# EAGLE schematic PIC Development Board (EAGLE 7.5.0)

## Sheet 1 of 4
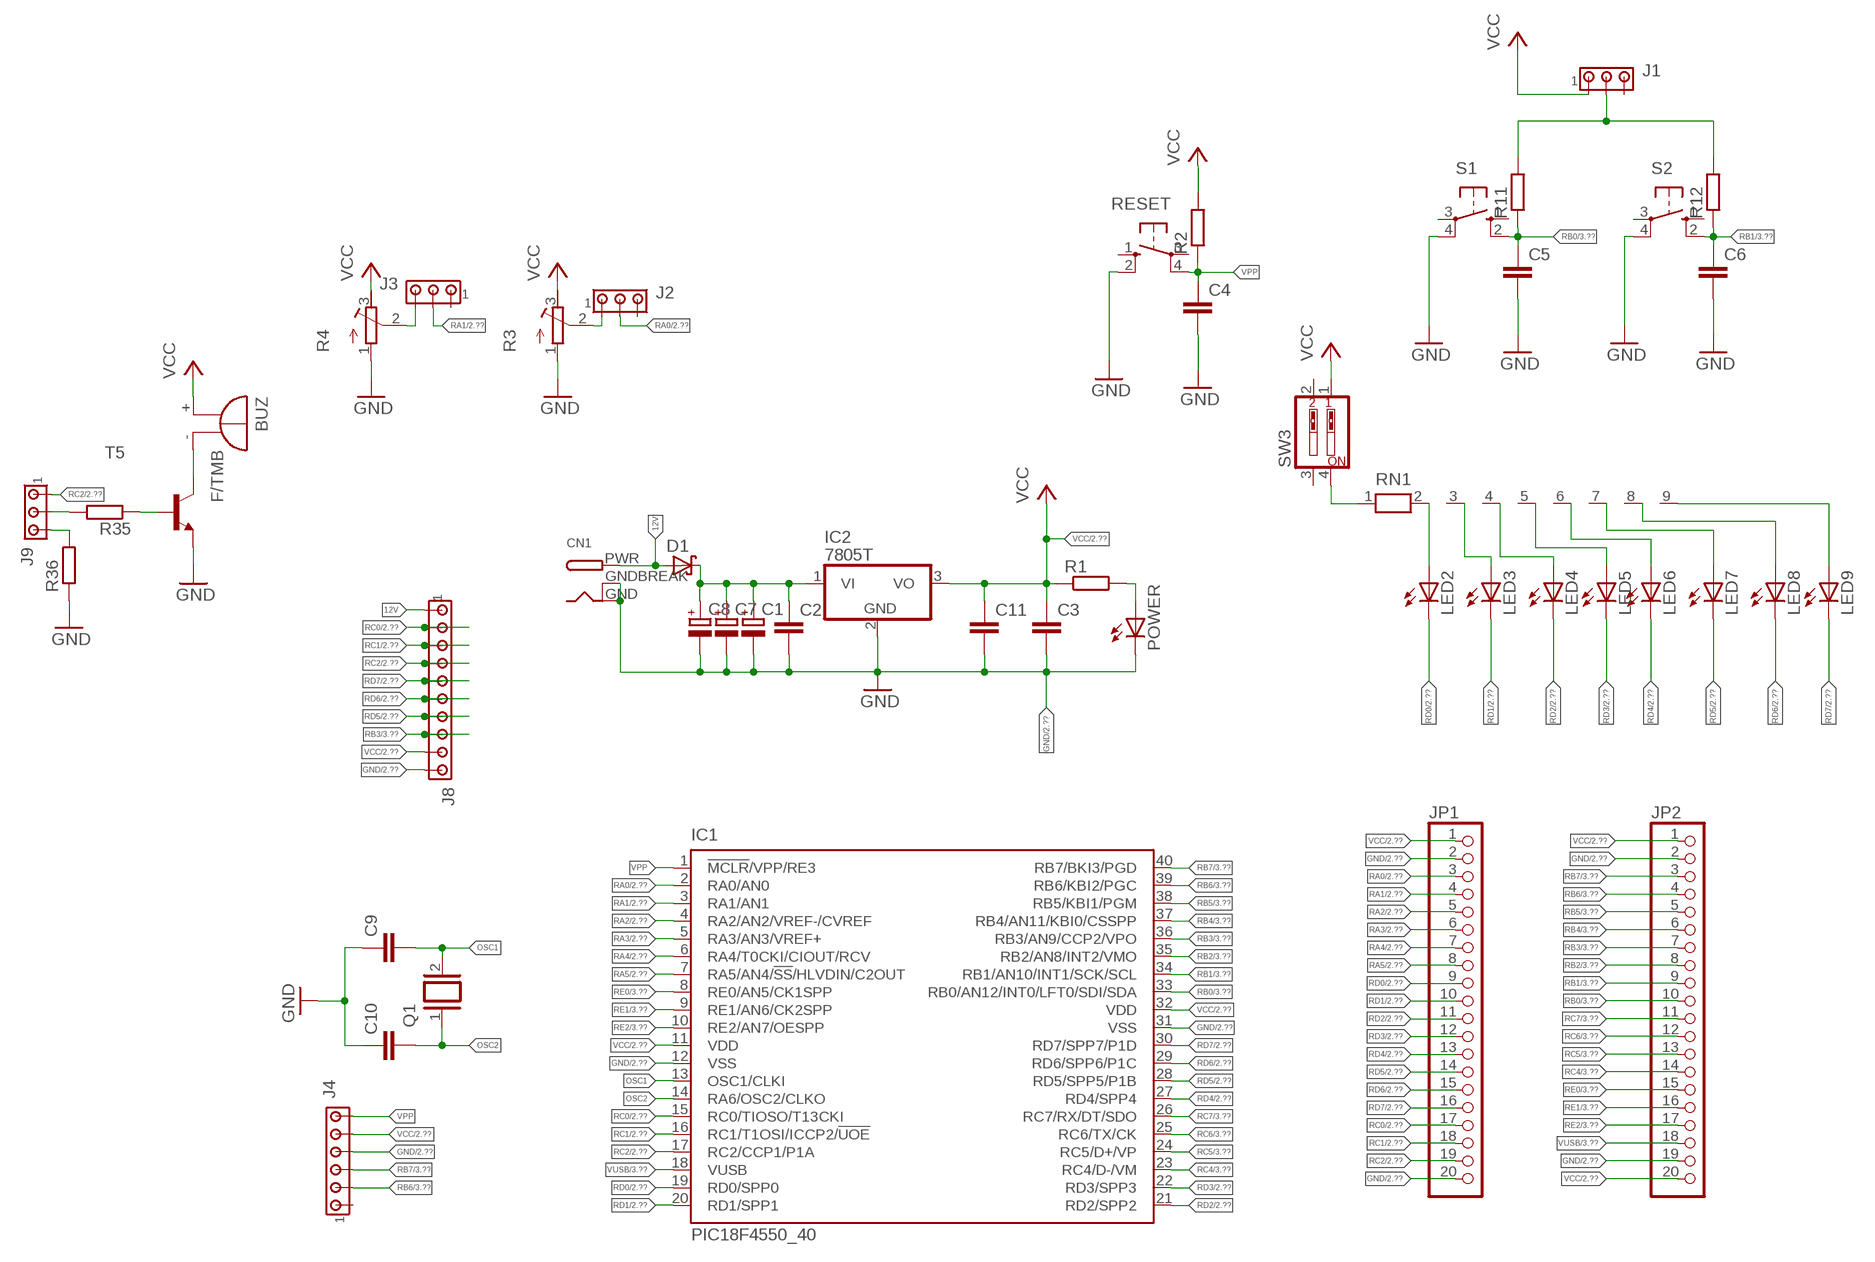
[diagram p0: schematic, sheet 1]

### Parts
BUZ  F/TMB  [F/TMB]
C1  CPOL-EUE2,5-6E  [E2,5-6E]
C2  C-EU050-025X075  [C050-025X075]
C3  C-EU050-025X075  [C050-025X075]
C4  C-EU050-025X075  [C050-025X075]
C5  C-EU025-024X044  [C025-024X044]
C6  C-EU025-024X044  [C025-024X044]
C7  CPOL-EUE2,5-6E  [E2,5-6E]
C8  CPOL-EUE2,5-6E  [E2,5-6E]
C9  C-EU025-030X050  [C025-030X050]
C10  C-EU025-030X050  [C025-030X050]
C11  C-EU050-025X075  [C050-025X075]
CN1  DCBARRELPTH  [DCJACK_2MM_PTH]
D1  SCHOTTKY-DIODEF126Z12  [F126Z12]
IC1  PIC18F4550_40  [DIL40]
IC2  7805T  [TO220H]
J1  MTA03-100  [10X03MTA]
J2  MTA03-100  [10X03MTA]
J3  MTA03-100  [10X03MTA]
J4  MTA06-100  [10X06MTA]
J8  MTA10-100  [10X10MTA]
J9  MTA03-100  [10X03MTA]
JP1  PINHD-1X20  [1X20]
JP2  PINHD-1X20  [1X20]
LED2  LEDSQR2X5  [LED2X5]
LED3  LEDSQR2X5  [LED2X5]
LED4  LEDSQR2X5  [LED2X5]
LED5  LEDSQR2X5  [LED2X5]
LED6  LEDSQR2X5  [LED2X5]
LED7  LEDSQR2X5  [LED2X5]
LED8  LEDSQR2X5  [LED2X5]
LED9  LEDSQR2X5  [LED2X5]
POWER  LED3MM  [LED3MM]
Q1  XTAL/S  [QS]
R1  R-EU_0204/7  [0204/7]
R2  R-EU_0204/7  [0204/7]
R3  R-TRIMM3296P  [RTRIM3296P]
R4  R-TRIMM3296P  [RTRIM3296P]
R11  R-EU_0204/7  [0204/7]
R12  R-EU_0204/7  [0204/7]
R35  R-EU_0204/7  [0204/7]
R36  R-EU_0204/7  [0204/7]
RESET  10-XX  [B3F-10XX]
RN1  RN08  [RN-9]
S1  10-XX  [B3F-10XX]
S2  10-XX  [B3F-10XX]
SW3  SW_DIP-2  [EDG-02]
T5  BC547A-NPN-TO92-CBE  [TO92-CBE]

### Nets
12V: CN1.PWR D1.A J8.1
GND: C1.- C2.2 C3.2 C4.2 C5.2 C6.2 C7.- C8.- C9.1 C10.1 C11.2 CN1.GND CN1.GNDBREAK IC1.12(VSS) IC1.31(VSS) IC2.2(GND) J4.4 J8.10 JP1.2 JP1.20 JP2.2 JP2.19 POWER.K(C) R3.1(A) R4.1(A) R36.1 RESET.2(S1) S1.4(P1) S2.4(P1) T5.E ; also sheet 2,3
N$1: C1.+ C2.1 C7.+ C8.+ D1.C IC2.1(VI)
N$2: LED2.A RN1.2
N$3: J9.2 R35.2
N$4: LED3.A RN1.3
N$5: POWER.A R1.2
N$6: J2.1 R3.2(S)
N$7: LED4.A RN1.4
N$8: LED5.A RN1.5
N$9: LED6.A RN1.6
N$10: LED7.A RN1.7
N$11: LED8.A RN1.8
N$12: LED9.A RN1.9
N$14: J3.3 R4.2(S)
N$18: RN1.1 SW3.4
N$56: J1.2 R11.2 R12.2
N$57: BUZ.- T5.C
N$58: R35.1 T5.B
N$59: J9.3 R36.2
OSC1: C9.2 IC1.13(OSC1/CLKI) Q1.2
OSC2: C10.2 IC1.14(RA6/OSC2/CLKO) Q1.1
RA0: IC1.2(RA0/AN0) J2.2 JP1.3 ; also sheet 2
RA1: IC1.3(RA1/AN1) J3.2 JP1.4 ; also sheet 2
RA2: IC1.4(RA2/AN2/VREF-/CVREF) JP1.5 ; also sheet 2
RA3: IC1.5(RA3/AN3/VREF+) JP1.6 ; also sheet 2
RA4: IC1.6(RA4/T0CKI/CIOUT/RCV) JP1.7 ; also sheet 2
RA5: IC1.7(RA5/AN4/!SS!/HLVDIN/C2OUT) JP1.8 ; also sheet 2
RB0: C5.1 IC1.33(RB0/AN12/INT0/LFT0/SDI/SDA) JP2.10 R11.1 S1.2(S1) ; also sheet 3
RB1: C6.1 IC1.34(RB1/AN10/INT1/SCK/SCL) JP2.9 R12.1 S2.2(S1) ; also sheet 3
RB2: IC1.35(RB2/AN8/INT2/VMO) JP2.8 ; also sheet 3
RB3: IC1.36(RB3/AN9/CCP2/VPO) J8.8 JP2.7 ; also sheet 3
RB4: IC1.37(RB4/AN11/KBI0/CSSPP) JP2.6 ; also sheet 3
RB5: IC1.38(RB5/KBI1/PGM) JP2.5 ; also sheet 3
RB6: IC1.39(RB6/KBI2/PGC) J4.2 JP2.4 ; also sheet 3
RB7: IC1.40(RB7/BKI3/PGD) J4.3 JP2.3 ; also sheet 3
RC0: IC1.15(RC0/TIOSO/T13CKI) J8.2 JP1.17 ; also sheet 2
RC1: IC1.16(RC1/T1OSI/ICCP2/!UOE) J8.3 JP1.18 ; also sheet 2
RC2: IC1.17(RC2/CCP1/P1A) J8.4 J9.1 JP1.19 ; also sheet 2
RC4: IC1.23(RC4/D-/VM) JP2.14 ; also sheet 3
RC5: IC1.24(RC5/D+/VP) JP2.13 ; also sheet 3
RC6: IC1.25(RC6/TX/CK) JP2.12 ; also sheet 3
RC7: IC1.26(RC7/RX/DT/SDO) JP2.11 ; also sheet 3
RD0: IC1.19(RD0/SPP0) JP1.9 LED2.K(C) ; also sheet 2
RD1: IC1.20(RD1/SPP1) JP1.10 LED3.K(C) ; also sheet 2
RD2: IC1.21(RD2/SPP2) JP1.11 LED4.K(C) ; also sheet 2
RD3: IC1.22(RD3/SPP3) JP1.12 LED5.K(C) ; also sheet 2
RD4: IC1.27(RD4/SPP4) JP1.13 LED6.K(C) ; also sheet 2
RD5: IC1.28(RD5/SPP5/P1B) J8.7 JP1.14 LED7.K(C) ; also sheet 2
RD6: IC1.29(RD6/SPP6/P1C) J8.6 JP1.15 LED8.K(C) ; also sheet 2
RD7: IC1.30(RD7/SPP7/P1D) J8.5 JP1.16 LED9.K(C) ; also sheet 2
RE0: IC1.8(RE0/AN5/CK1SPP) JP2.15 ; also sheet 3
RE1: IC1.9(RE1/AN6/CK2SPP) JP2.16 ; also sheet 3
RE2: IC1.10(RE2/AN7/OESPP) JP2.17 ; also sheet 3
VCC: BUZ.+ C3.1 C11.1 IC1.11(VDD) IC1.32(VDD) IC2.3(VO) J1.1 J4.5 J8.9 JP1.1 JP2.1 JP2.20 R1.1 R2.2 R3.3(E) R4.3(E) SW3.1 ; also sheet 2,3
VPP: C4.1 IC1.1(!MCLR!/VPP/RE3) J4.6 R2.1 RESET.4(P1)
VUSB: IC1.18(VUSB) JP2.18 ; also sheet 3
Unconnected: J1.3 J2.3 J3.1 J4.1 RESET.1(S) RESET.3(P) S1.1(S) S1.3(P) S2.1(S) S2.3(P) SW3.2 SW3.3

## Sheet 2 of 4
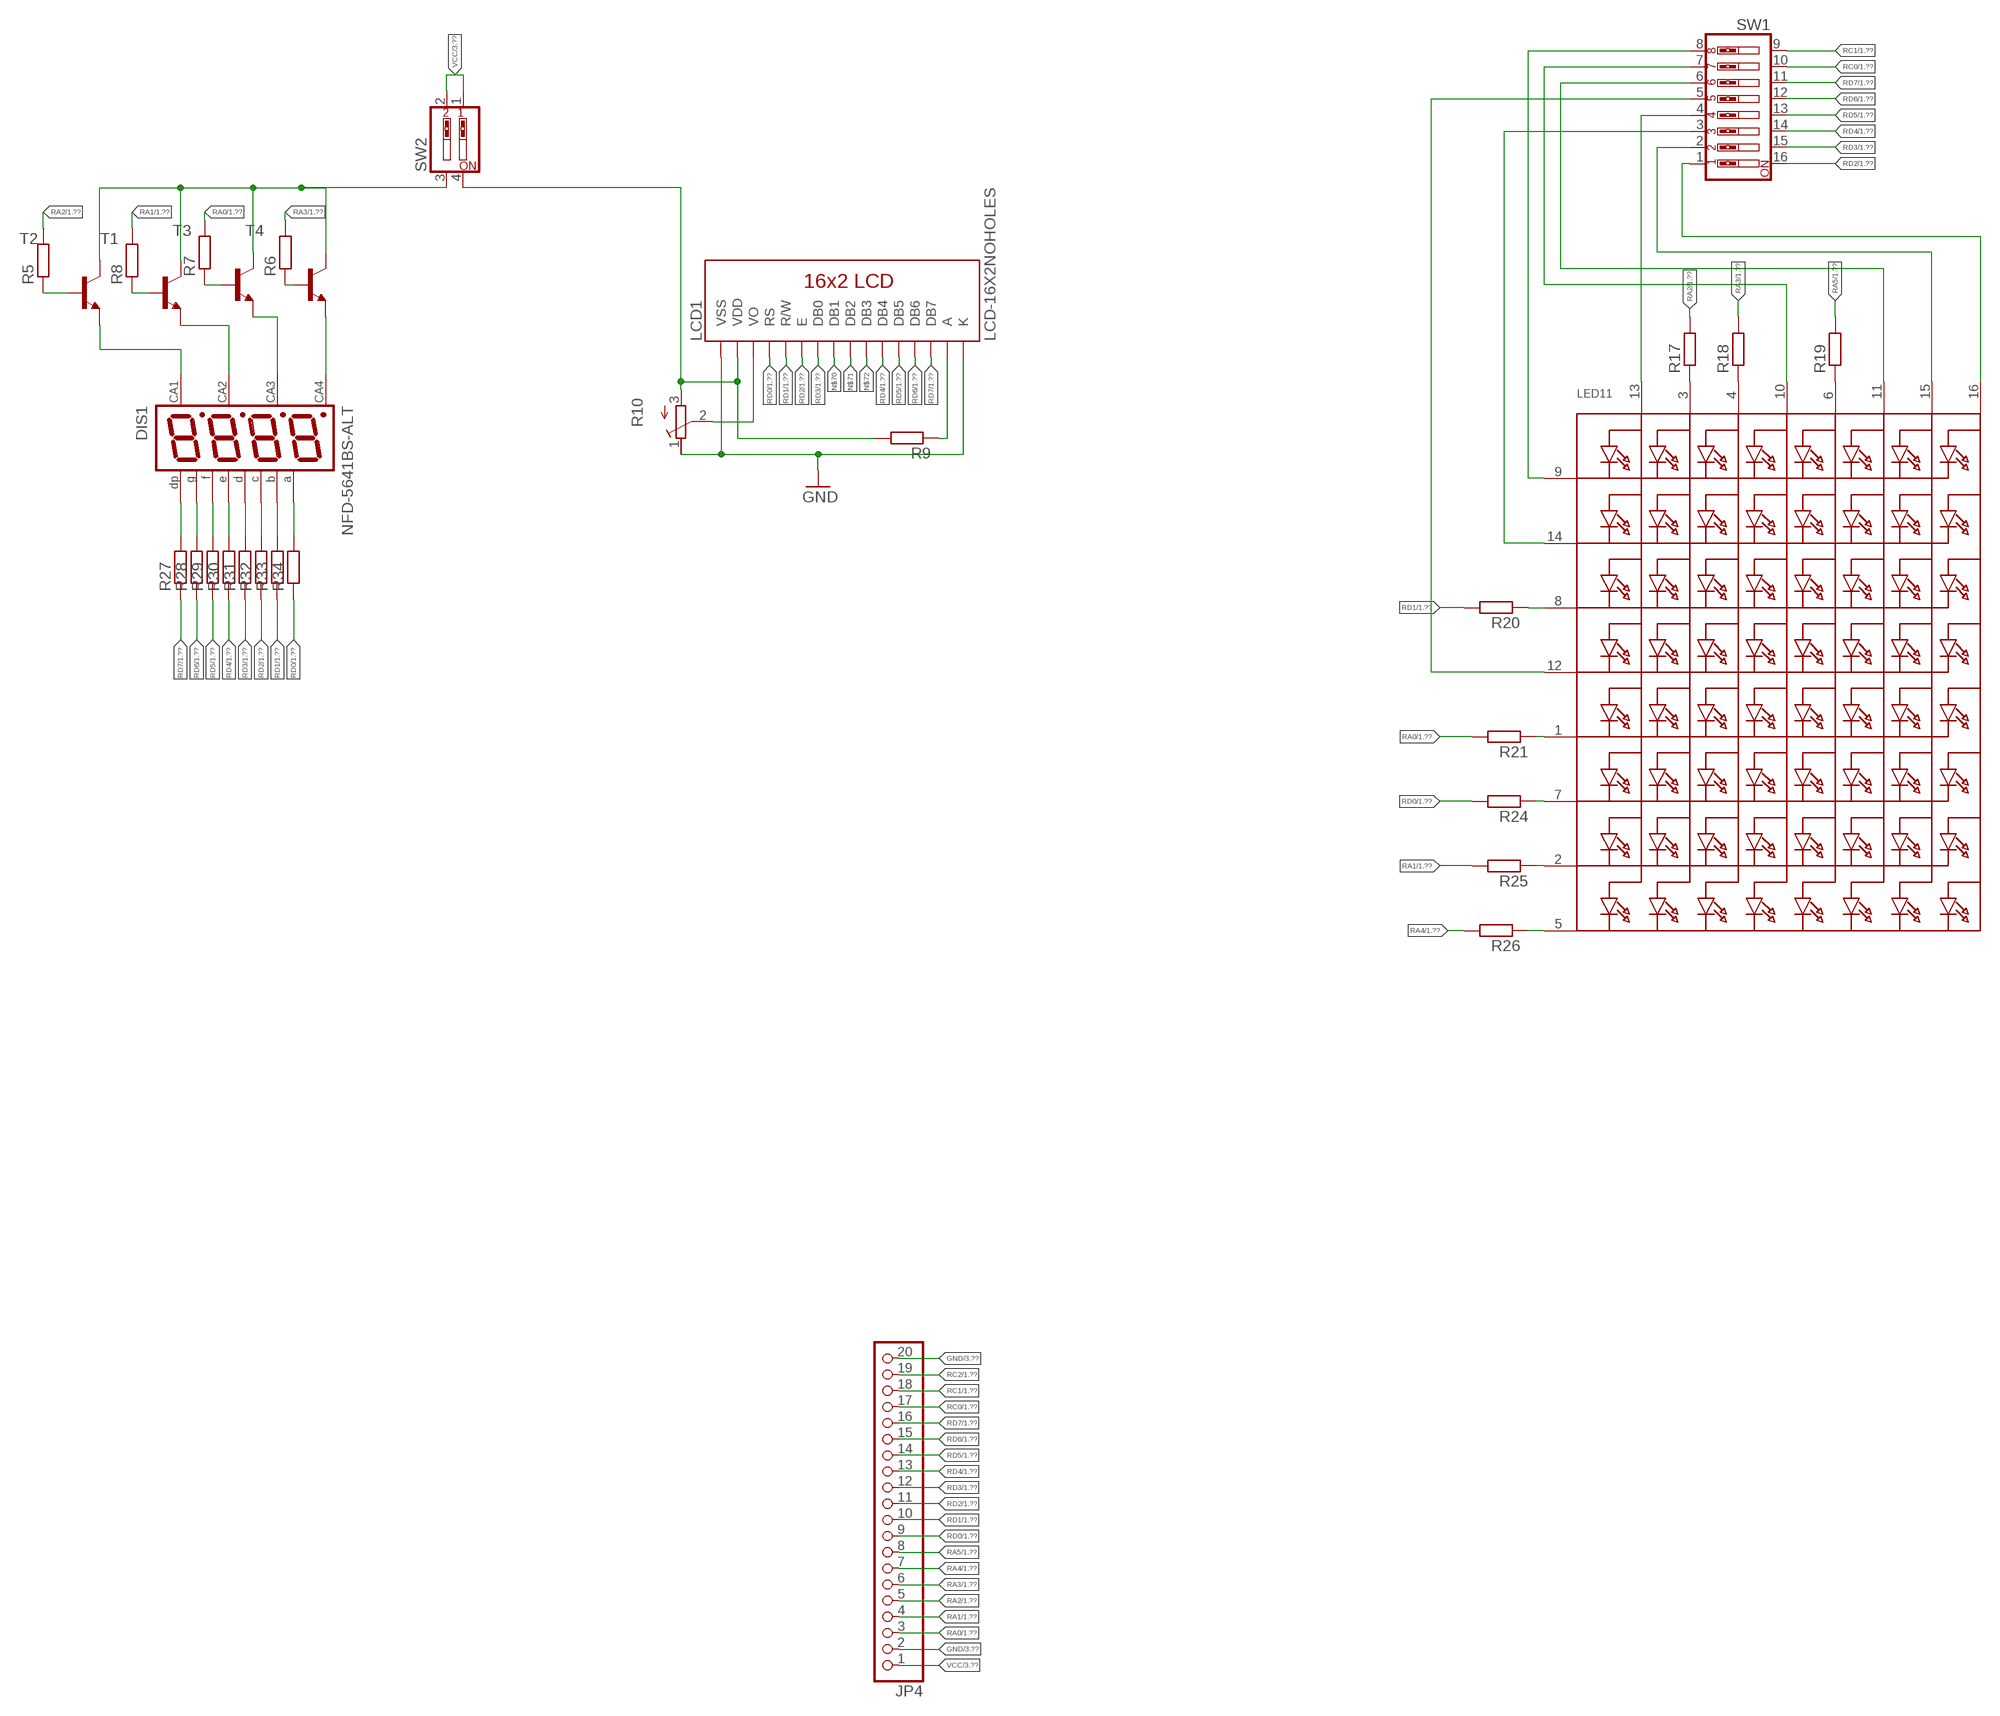
[diagram p1: schematic, sheet 2]

### Parts
DIS1  NFD-5641BS-ALT  [NFD-5641]
JP4  PINHD-1X20  [1X20]
LCD1  LCD-16X2NOHOLES  [LCD-16X2_NOHOLESNOSILK]
LED11  SEGMENT_8X8_ROWCATHODEM12A881UR  [SEGMENT_BL-M12A881UR]
R5  R-EU_0204/7  [0204/7]
R6  R-EU_0204/7  [0204/7]
R7  R-EU_0204/7  [0204/7]
R8  R-EU_0204/7  [0204/7]
R9  R-EU_0204/7  [0204/7]
R10  R-TRIMMT93YA  [RTRIMT93YA]
R17  R-EU_0204/7  [0204/7]
R18  R-EU_0204/7  [0204/7]
R19  R-EU_0204/7  [0204/7]
R20  R-EU_0204/7  [0204/7]
R21  R-EU_0204/7  [0204/7]
R24  R-EU_0204/7  [0204/7]
R25  R-EU_0204/7  [0204/7]
R26  R-EU_0204/7  [0204/7]
R27  R-EU_0204/7  [0204/7]
R28  R-EU_0204/7  [0204/7]
R29  R-EU_0204/7  [0204/7]
R30  R-EU_0204/7  [0204/7]
R31  R-EU_0204/7  [0204/7]
R32  R-EU_0204/7  [0204/7]
R33  R-EU_0204/7  [0204/7]
R34  R-EU_0204/7  [0204/7]
SW1  SW_DIP-8  [EDG-08]
SW2  SW_DIP-2  [EDG-02]
T1  BC547-NPN-TO92-CBE  [TO92-CBE]
T2  BC547-NPN-TO92-CBE  [TO92-CBE]
T3  BC547-NPN-TO92-CBE  [TO92-CBE]
T4  BC547-NPN-TO92-CBE  [TO92-CBE]

### Nets
GND: JP4.2 JP4.20 LCD1.1(VSS) LCD1.16(K) R10.1(E) ; also sheet 1,3
N$13: DIS1.P$8 T3.E
N$15: DIS1.P$9 T1.E
N$16: DIS1.P$12 T2.E
N$17: LCD1.15(A) R9.1
N$19: LCD1.3(VO) R10.2(S)
N$20: DIS1.P$6 T4.E
N$21: SW2.3 T1.C T2.C T3.C T4.C
N$22: R6.1 T4.B
N$23: R7.1 T3.B
N$24: R8.1 T1.B
N$25: R5.1 T2.B
N$26: LCD1.2(VDD) R9.2 R10.3(A) SW2.4
N$28: LED11.9(K1) SW1.8
N$29: LED11.10(A4) SW1.7
N$30: LED11.11(A6) SW1.6
N$31: LED11.12(K4) SW1.5
N$32: LED11.14(K2) SW1.3
N$33: LED11.6(A5) R19.1
N$34: LED11.4(A3) R18.1
N$35: LED11.3(A2) R17.1
N$36: LED11.8(K3) R20.1
N$37: LED11.1(K5) R21.1
N$38: LED11.7(K6) R24.1
N$39: LED11.2(K7) R25.1
N$40: LED11.5(K8) R26.1
N$45: DIS1.P$3 R27.2
N$46: DIS1.P$5 R28.2
N$47: DIS1.P$10 R29.2
N$51: DIS1.P$1 R30.2
N$52: DIS1.P$2 R31.2
N$53: DIS1.P$4 R32.2
N$54: DIS1.P$7 R33.2
N$55: DIS1.P$11 R34.2
N$70: LCD1.8(DB1)
N$71: LCD1.9(DB2)
N$72: LCD1.10(DB3)
RA0: JP4.3 R7.2 R21.2 ; also sheet 1
RA1: JP4.4 R8.2 R25.2 ; also sheet 1
RA2: JP4.5 R5.2 R17.2 ; also sheet 1
RA3: JP4.6 R6.2 R18.2 ; also sheet 1
RA4: JP4.7 R26.2 ; also sheet 1
RA5: JP4.8 R19.2 ; also sheet 1
RC0: JP4.17 SW1.10 ; also sheet 1
RC1: JP4.18 SW1.9 ; also sheet 1
RC2: JP4.19 ; also sheet 1
RD0: JP4.9 LCD1.4(RS) R24.2 R34.1 ; also sheet 1
RD1: JP4.10 LCD1.5(R/W) R20.2 R33.1 ; also sheet 1
RD2: JP4.11 LCD1.6(E) LED11.16(A8) R32.1 SW1.1 SW1.16 ; also sheet 1
RD3: JP4.12 LCD1.7(DB0) LED11.15(A7) R31.1 SW1.2 SW1.15 ; also sheet 1
RD4: JP4.13 LCD1.11(DB4) R30.1 SW1.14 ; also sheet 1
RD5: JP4.14 LCD1.12(DB5) LED11.13(A1) R29.1 SW1.4 SW1.13 ; also sheet 1
RD6: JP4.15 LCD1.13(DB6) R28.1 SW1.12 ; also sheet 1
RD7: JP4.16 LCD1.14(DB7) R27.1 SW1.11 ; also sheet 1
VCC: JP4.1 SW2.1 SW2.2 ; also sheet 1,3

## Sheet 3 of 4
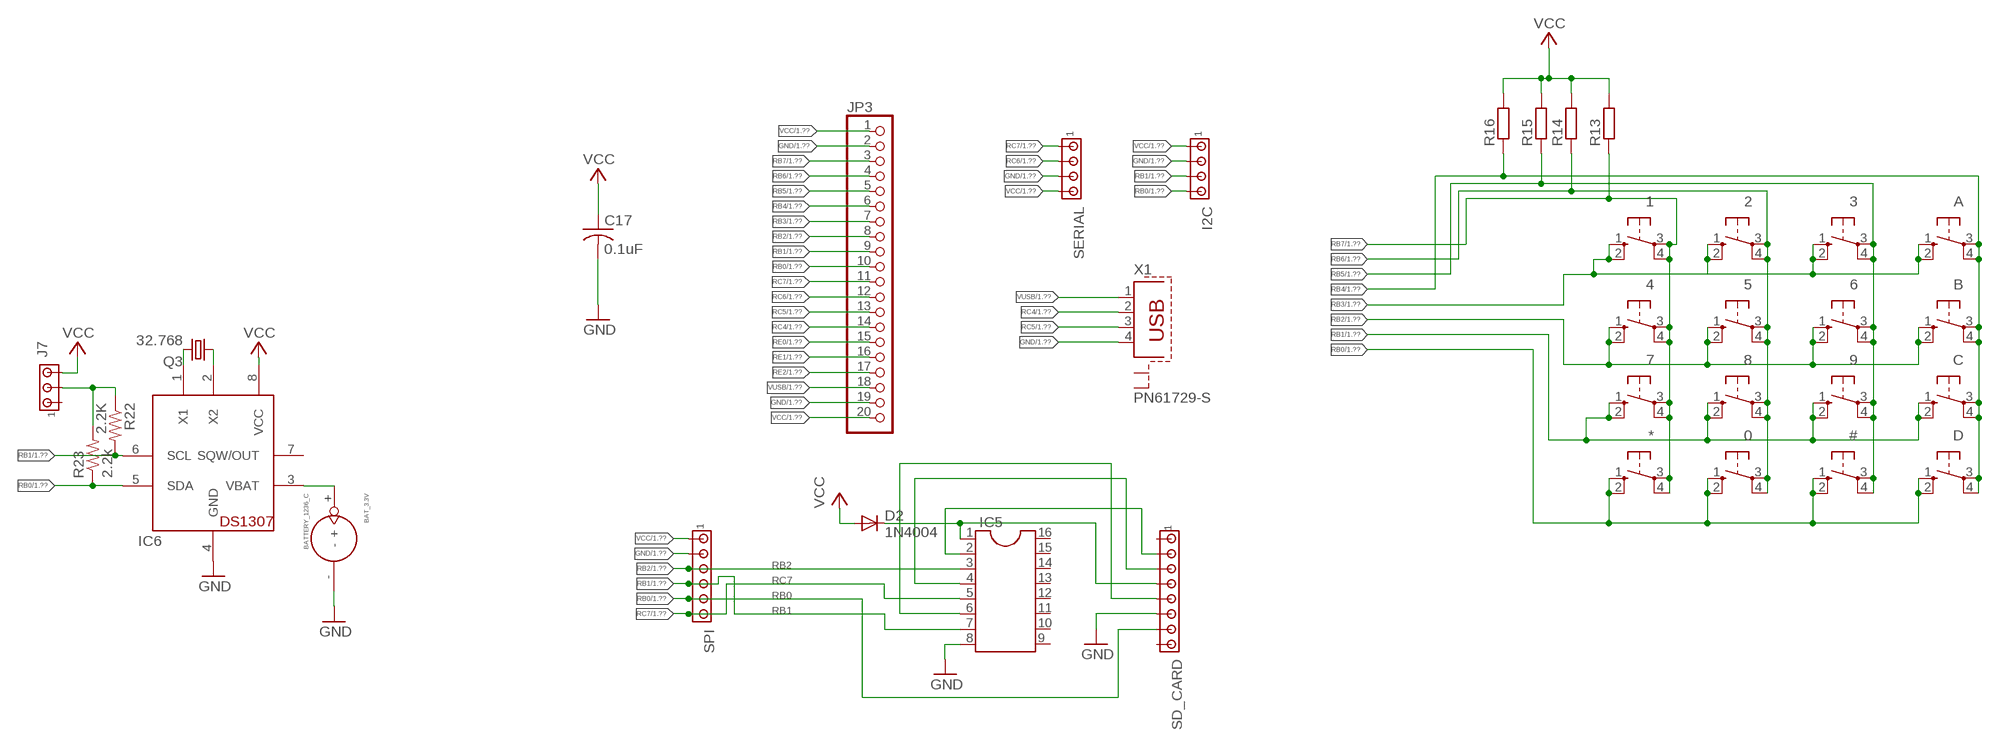
[diagram p2: schematic, sheet 3]

### Parts
0  10-XX  [B3F-10XX]
1  10-XX  [B3F-10XX]
2  10-XX  [B3F-10XX]
3  10-XX  [B3F-10XX]
4  10-XX  [B3F-10XX]
5  10-XX  [B3F-10XX]
6  10-XX  [B3F-10XX]
7  10-XX  [B3F-10XX]
8  10-XX  [B3F-10XX]
9  10-XX  [B3F-10XX]
#  10-XX  [B3F-10XX]
*  10-XX  [B3F-10XX]
A  10-XX  [B3F-10XX]
B  10-XX  [B3F-10XX]
BAT_3.3V  BATTERY_1236_C  [BATTERY_1236_C]
C  10-XX  [B3F-10XX]
C17  0.1uF  C-US025-025X050  [C025-025X050]
D  10-XX  [B3F-10XX]
D2  1N4004  [DO41-10]
I2C  MTA04-100  [10X04MTA]
IC5  DIL16  [DIL16]
IC6  DS1307  [DIL08]
J7  MTA03-100  [10X03MTA]
JP3  PINHD-1X20  [1X20]
Q3  32.768  CRYTALTC38H  [TC38H]
R13  R-EU_0204/7  [0204/7]
R14  R-EU_0204/7  [0204/7]
R15  R-EU_0204/7  [0204/7]
R16  R-EU_0204/7  [0204/7]
R22  2.2K  R-US_0204/7  [0204/7]
R23  2.2k  R-US_0204/7  [0204/7]
SD_CARD  MTA08-100  [10X08MTA]
SERIAL  MTA04-100  [10X04MTA]
SPI  MTA06-100  [10X06MTA]
X1  PN61729-S  [PN61729-S]

### Nets
GND: BAT_3.3V.- C17.2 I2C.2 IC5.8 IC6.4(GND) JP3.2 JP3.19 SD_CARD.6 SERIAL.3 SPI.2 X1.4 ; also sheet 1,2
N$27: J7.2 R22.1 R23.2
N$41: IC6.1(X1) Q3.2
N$42: IC6.2(X2) Q3.1
N$43: BAT_3.3V.+ IC6.3(VBAT)
N$44: D2.C IC5.1 SD_CARD.4
N$48: IC5.2 SD_CARD.2
N$49: IC5.4 SD_CARD.3
N$50: IC5.6 SD_CARD.5
RB0: 0.1(S) 0.2(S1) #.1(S) #.2(S1) *.1(S) *.2(S1) D.1(S) D.2(S1) I2C.4 IC6.5(SDA) JP3.10 R23.1 SD_CARD.7 SPI.5 ; also sheet 1
RB1: 7.1(S) 7.2(S1) 8.1(S) 8.2(S1) 9.1(S) 9.2(S1) C.1(S) C.2(S1) I2C.3 IC5.7 IC6.6(SCL) JP3.9 R22.2 SPI.4 ; also sheet 1
RB2: 4.1(S) 4.2(S1) 5.1(S) 5.2(S1) 6.1(S) 6.2(S1) B.1(S) B.2(S1) IC5.3 JP3.8 SPI.3 ; also sheet 1
RB3: 1.1(S) 1.2(S1) 2.1(S) 2.2(S1) 3.1(S) 3.2(S1) A.1(S) A.2(S1) JP3.7 ; also sheet 1
RB4: A.3(P) A.4(P1) B.3(P) B.4(P1) C.3(P) C.4(P1) D.3(P) D.4(P1) JP3.6 R16.1 ; also sheet 1
RB5: 3.3(P) 3.4(P1) 6.3(P) 6.4(P1) 9.3(P) 9.4(P1) #.3(P) #.4(P1) JP3.5 R15.1 ; also sheet 1
RB6: 0.3(P) 0.4(P1) 2.3(P) 2.4(P1) 5.3(P) 5.4(P1) 8.3(P) 8.4(P1) JP3.4 R14.1 ; also sheet 1
RB7: 1.3(P) 1.4(P1) 4.3(P) 4.4(P1) 7.3(P) 7.4(P1) *.3(P) *.4(P1) JP3.3 R13.1 ; also sheet 1
RC4: JP3.14 X1.2 ; also sheet 1
RC5: JP3.13 X1.3 ; also sheet 1
RC6: JP3.12 SERIAL.2 ; also sheet 1
RC7: IC5.5 JP3.11 SERIAL.1 SPI.6 ; also sheet 1
RE0: JP3.15 ; also sheet 1
RE1: JP3.16 ; also sheet 1
RE2: JP3.17 ; also sheet 1
VCC: C17.1 D2.A I2C.1 IC6.8(VCC) J7.3 JP3.1 JP3.20 R13.2 R14.2 R15.2 R16.2 SERIAL.4 SPI.1 ; also sheet 1,2
VUSB: JP3.18 X1.1 ; also sheet 1
Unconnected: IC5.9 IC5.10 IC5.11 IC5.12 IC5.13 IC5.14 IC5.15 IC5.16 IC6.7(SQW/OUT) J7.1 SD_CARD.1 SD_CARD.8 X1.S1 X1.S2

## Sheet 4 of 4

## Library data of the parts
0 1-9 # * A B C D RESET S1 S2 = switch-omron:10-XX: OMRON SWITCH; MPN: B3F-1000; OC_FARNELL: 176432; OC_NEWARK: 36M3542
BAT_3.3V = Itead_BP_110825.lbr:BATTERY_1236_C: SOC004
BUZ = buzzer:F/TMB: BUZZER Source: Buerklin; OC_FARNELL: unknown; OC_NEWARK: unknown
C1 C7 C8 = rcl:CPOL-EU: POLARIZED CAPACITOR, European symbol
C2-C6 C9-C11 = rcl:C-EU: CAPACITOR, European symbol
C17 = adafruit:C-US: CAPACITOR, American symbol
CN1 = adafruit:DCBARREL: 2.0mm DC Barrel Jack DCJACK_2MM_PTH - Through Hole Jack (4UConnector: 05537)
D1 = adafruit:SCHOTTKY-DIODE: Schottky Diode
D2 = adafruit:1N4004: DIODE General purpose 1N400x type rectifier (With bigger pads) http://www.ladyada.net/library/pcb/eaglelibrary.html
DIS1 = display-nfd:NFD-5641BS-ALT: Four Digit 0.56" CA Seven-Segment LED Display Futurlec part number: 7FR5641BS Created by RobG
I2C SERIAL = con-amp:MTA04-100: AMP connector
IC1 = microchip:PIC18F4*_40: USB Microcontrollers with nanoWatt Technology High-Performance, Enhanced Flash, 28/40/44-Pin, Source: http://ww1.microchip.com/downloads/en/devicedoc/39632c.pdf; MF: MICROCHIP; MPN: PIC18F4550-I/P; OC_FARNELL: 9321357; OC_NEWARK: 74K8623
IC2 = linear:78*: Positive VOLTAGE REGULATOR Source: http://cache.national.com/ds/LM/LM78L05.pdf http://www.fairchildsemi.com/ds/LM/LM7805.pdf
IC5 = ic-package:DIL16: Dual In Line / Socket
IC6 = adafruit:DS1307: DS1307 Real time clock (RTC) with battery backup ability. Talk to it via i2c
J1-J3 J7 J9 = con-amp:MTA03-100: AMP connector
J4 SPI = con-amp:MTA06-100: AMP connector Connection corrected 2014-09-19
J8 = con-amp:MTA10-100: AMP connector
JP1-JP4 = adafruit:PINHD-1X20: PIN HEADER
LCD1 = SparkFun-Displays:LCD-16X2: Standard text-only 16x2 parallel input LCD Basic 16 character by 2 line display. Typically utilizes the extremely common HD44780 parallel interface chipset SparkFun Products: Basic 16x2 Green <https://www.sparkfun.com/products/255> Basic 8x2 Green <https://www.sparkfun.com/products/11122>; SF_ID: LCD-00255
LED2-LED9 POWER = adafruit:LED: LED OSRAM: - CHIPLED LG R971, LG N971, LY N971, LG Q971, LY Q971, LO R971, LY R971 LH N974, LH R974 LS Q976, LO Q976, LY Q976 LO Q996 - Hyper CHIPLED LW Q18S LB Q993, LB Q99A, LB R99A - SideLED LS A670, LO A670, LY A670, LG A670, LP A670 LB A673, LV A673, LT A673, LW A673 LH A674 LY A675 LS A676, LA A676, LO A676, LY A676, LW A676 LS A679, LY A679, LG A679 - Hyper Micro SIDELED® LS Y876, LA Y876, LO Y876, LY Y876 LT Y87S - SmartLED LW L88C, LW L88S LB L89C, LB L89S, LG L890 LS L89K, LO L89K, LY L89K LS L896, LA L896, LO L896, LY L896 - TOPLED LS T670, LO T670, LY T670, LG T670, LP T670 LSG T670, LSP T670, LSY T670, LOP T670, LYG T670 LG T671, LOG T671, LSG T671 LB T673, LV T673, LT T673, LW T673 LH T674 LS T676, LA T676, LO T676, LY T676, LB T676, LH T676, LSB T676, LW T676 LB T67C, LV T67C, LT T67C, LS T67K, LO T67K, LY T67K, LW E67C LS E67B, LA E67B, LO E67B, LY E67B, LB E67C, LV E67C, LT E67C LW T67C LS T679, LY T679, LG T679 LS T770, LO T770, LY T770, LG T770, LP T770 LB T773, LV T773, LT T773, LW T773 LH T774 LS E675, LA E675, LY E675, LS T675 LS T776, LA T776, LO T776, LY T776, LB T776 LHGB T686 LT T68C, LB T68C - Hyper Mini TOPLED® LB M676 - Mini TOPLED Santana® LG M470 LS M47K, LO M47K, LY M47K Source: http://www.osram.convergy.de/
LED11 = adafruit:SEGMENT_8X8_ROWCATHODE: 8x8 LED Segment Displays: Row = Cathode 0.7" Red 8X8 Matrix, 1.9mm Round LEDs - BL-M07C881UR 1.2" Red 8x8 Matrix, 3.0mm Round LEDs - BL-M12A881UR 1.2" Red 8x8 Matrix, 3.0mm Square LEDs - BL-M12A883
Q1 = special:XTAL/S: CRYSTAL
Q3 = crystal:CRYTAL: CRYSTAL
R1 R2 R5-R9 R11-R21 R24-R36 = rcl:R-EU_: RESISTOR, European symbol
R3 R4 = rcl:R-TRIMM: Trimm resistor
R10 = resistor:R-TRIMM: Trimm resistor
R22 R23 = adafruit:R-US_: RESISTOR, American symbol
RN1 = resistor-net:RN08: RESISTOR NETWORK; OC_FARNELL: unknown; OC_NEWARK: unknown
SD_CARD = con-amp:MTA08-100: AMP connector
SW1 = special:SW_DIP-8: DIP SWITCH
SW2 SW3 = special:SW_DIP-2: DIP SWITCH
T1-T5 = transistor:*-NPN-: NPN Transistror BF959 corrected 2008.03.06
X1 = con-berg:PN61729-S: BERG USB connector; OC_FARNELL: unknown; OC_NEWARK: unknown